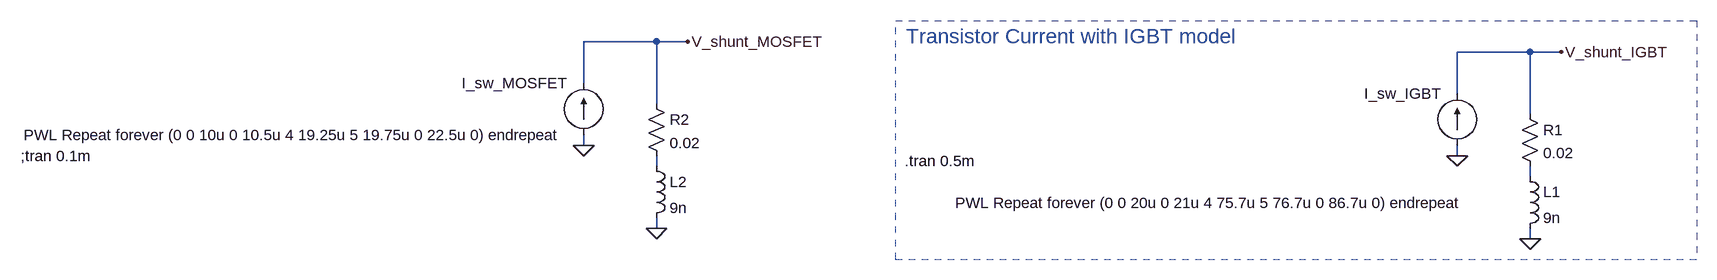
[diagram p0: schematic Current_sensor_fun.asc]
Current_sensor_fun.asc, the LTspice schematic file:
Version 4
SHEET 1 880 680
WIRE -1312 48 -1424 48
WIRE -1264 48 -1312 48
WIRE 32 64 -80 64
WIRE 80 64 32 64
WIRE -1424 112 -1424 48
WIRE -80 128 -80 64
WIRE -1312 144 -1312 48
WIRE 32 160 32 64
WIRE -1424 208 -1424 192
WIRE -80 224 -80 208
WIRE -1312 240 -1312 224
WIRE 32 256 32 240
WIRE -1312 336 -1312 320
WIRE 32 352 32 336
FLAG 32 352 0
FLAG -80 224 0
FLAG 80 64 V_shunt_IGBT
FLAG -1312 336 0
FLAG -1424 208 0
FLAG -1264 48 V_shunt_MOSFET
SYMBOL res 16 144 R0
SYMATTR InstName R1
SYMATTR Value 0.02
SYMBOL current -80 208 R180
WINDOW 0 24 80 Left 2
WINDOW 3 -18 -89 Left 2
SYMATTR InstName I_sw_IGBT
SYMATTR Value PWL Repeat forever (0 0 20u 0 21u 4 75.7u 5 76.7u 0 86.7u 0) endrepeat
SYMBOL ind 16 240 R0
SYMATTR InstName L1
SYMATTR Value 9n
SYMBOL res -1328 128 R0
SYMATTR InstName R2
SYMATTR Value 0.02
SYMBOL current -1424 192 R180
WINDOW 0 24 80 Left 2
WINDOW 3 24 0 Left 2
SYMATTR InstName I_sw_MOSFET
SYMATTR Value PWL Repeat forever (0 0 10u 0 10.5u 4 19.25u 5 19.75u 0 22.5u 0) endrepeat
SYMBOL ind -1328 224 R0
SYMATTR InstName L2
SYMATTR Value 9n
TEXT -930 232 Left 2 !.tran 0.5m
TEXT -928 40 Left 3 ;Transistor Current with IGBT model
TEXT -2290 224 Left 2 !;tran 0.1m
RECTANGLE Normal 288 384 -944 16 2

The netlist it stands for:
* Current_sensor_fun.asc
R1 V_shunt_IGBT N002 0.02
I_sw_IGBT 0 V_shunt_IGBT PWL Repeat forever (0 0 20u 0 21u 4 75.7u 5 76.7u 0 86.7u 0) endrepeat
L1 N002 0 9n
R2 V_shunt_MOSFET N001 0.02
I_sw_MOSFET 0 V_shunt_MOSFET PWL Repeat forever (0 0 10u 0 10.5u 4 19.25u 5 19.75u 0 22.5u 0) endrepeat
L2 N001 0 9n
.tran 0.5m
* Transistor Current with IGBT model
;tran 0.1m
.backanno
.end

* Results of the author's LTspice run, read from the files saved beside the schematic
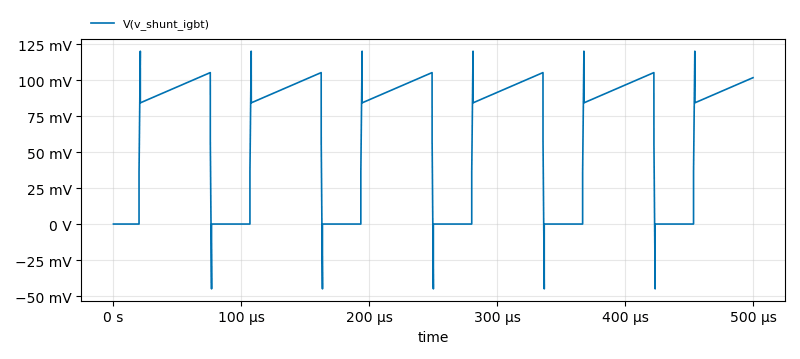
[diagram p1: Transient Analysis of Current_sensor_fun.asc, plotted from the saved traces]
* Transient Analysis, 1 run:
*   V(v_shunt_igbt): min -45 mV, max 120 mV, average 61.26 mV, rms 76.37 mV, last 101.6 mV